# Altium schematic sheet Block.SchDoc
size A2; SheetNumber: 1; SheetTotal: 7
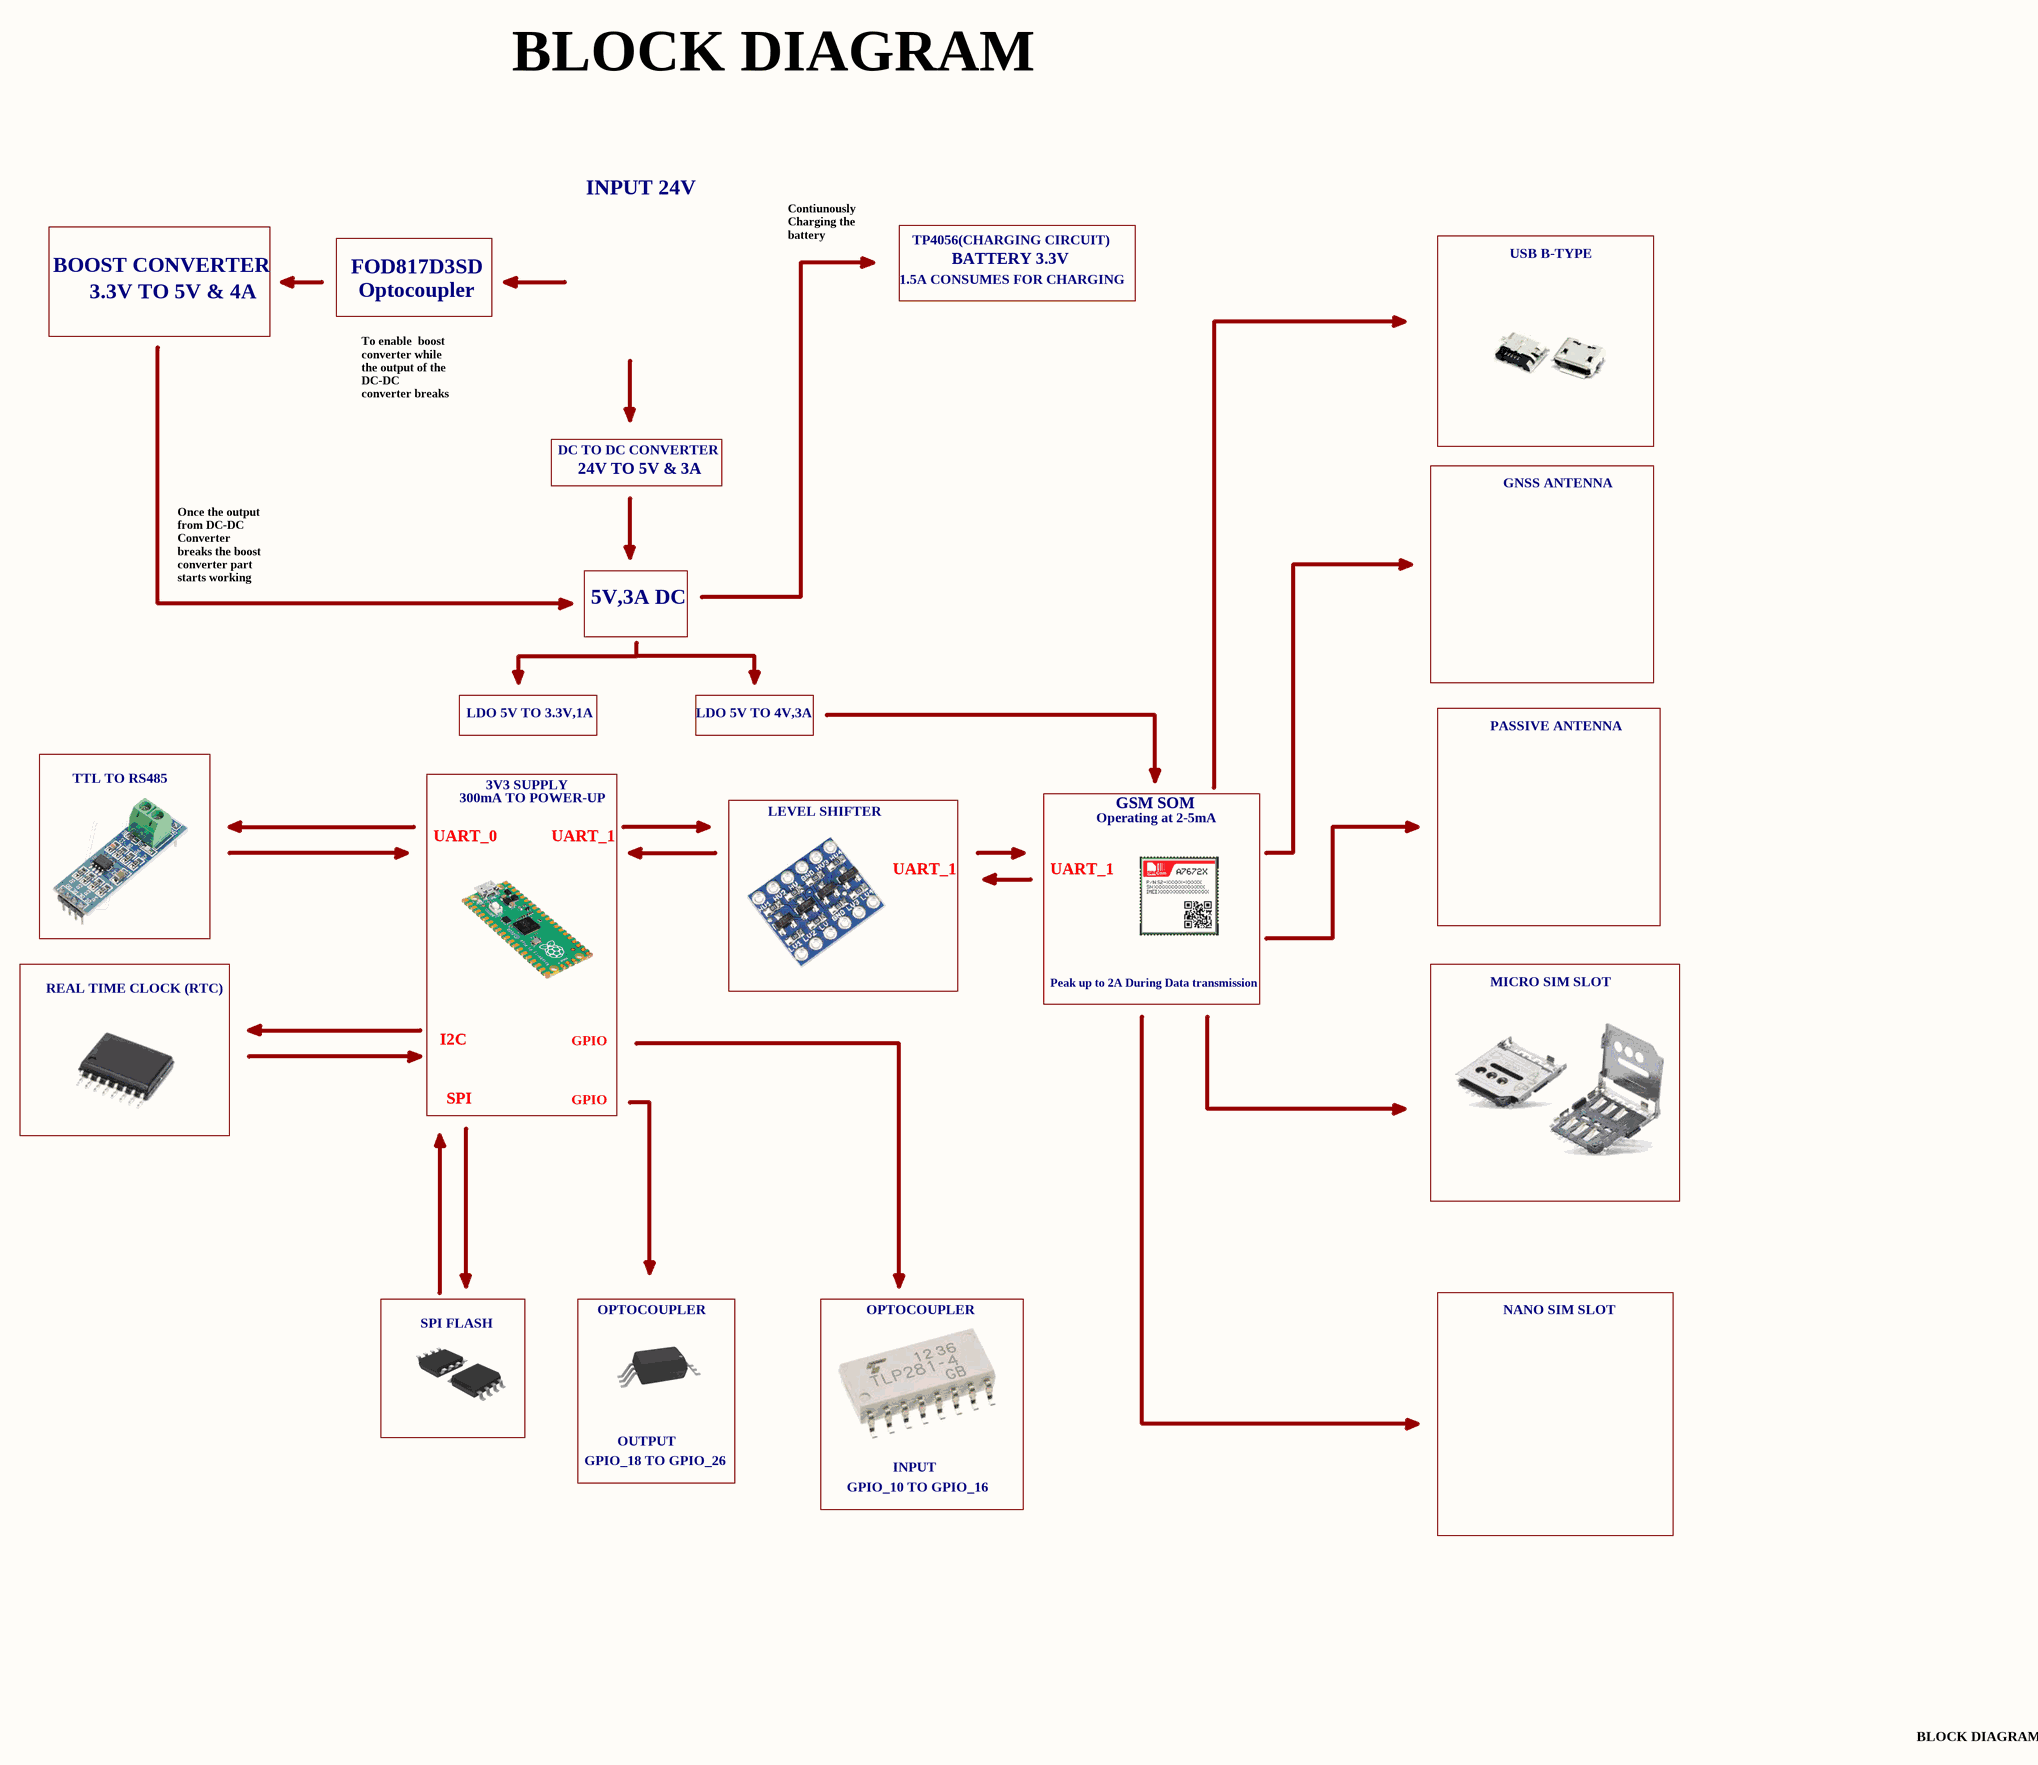
[diagram p0: Block.SchDoc]

## Notes on the sheet
- BLOCK DIAGRAM
- INPUT 24V
- Contiunously Charging the battery
- TP4056(CHARGING CIRCUIT)
- USB B-TYPE
- BOOST CONVERTER
- 3.3V TO 5V & 4A
- FOD817D3SD
- Optocoupler
- 1.5A CONSUMES FOR CHARGING
- BATTERY 3.3V
- To enable  boost converter while the output of the DC-DC converter breaks
- DC TO DC CONVERTER
- 24V TO 5V & 3A
- GNSS ANTENNA
- Once the output from DC-DC Converter breaks the boost converter part starts working
- 5V,3A DC
- LDO 5V TO 3.3V,1A
- LDO 5V TO 4V,3A
- TTL TO RS485
- PASSIVE ANTENNA
- UART_0
- 300mA TO POWER-UP
- 3V3 SUPPLY
- UART_1
- LEVEL SHIFTER
- Operating at 2-5mA
- GSM SOM
- Peak up to 2A During Data transmission
- MICRO SIM SLOT
- REAL TIME CLOCK (RTC)
- I2C
- GPIO
- SPI
- SPI FLASH
- OPTOCOUPLER
- NANO SIM SLOT
- GPIO_18 TO GPIO_26
- OUTPUT
- GPIO_10 TO GPIO_16
- INPUT